# EAGLE design A7105 reference design (EAGLE 9.3.0)
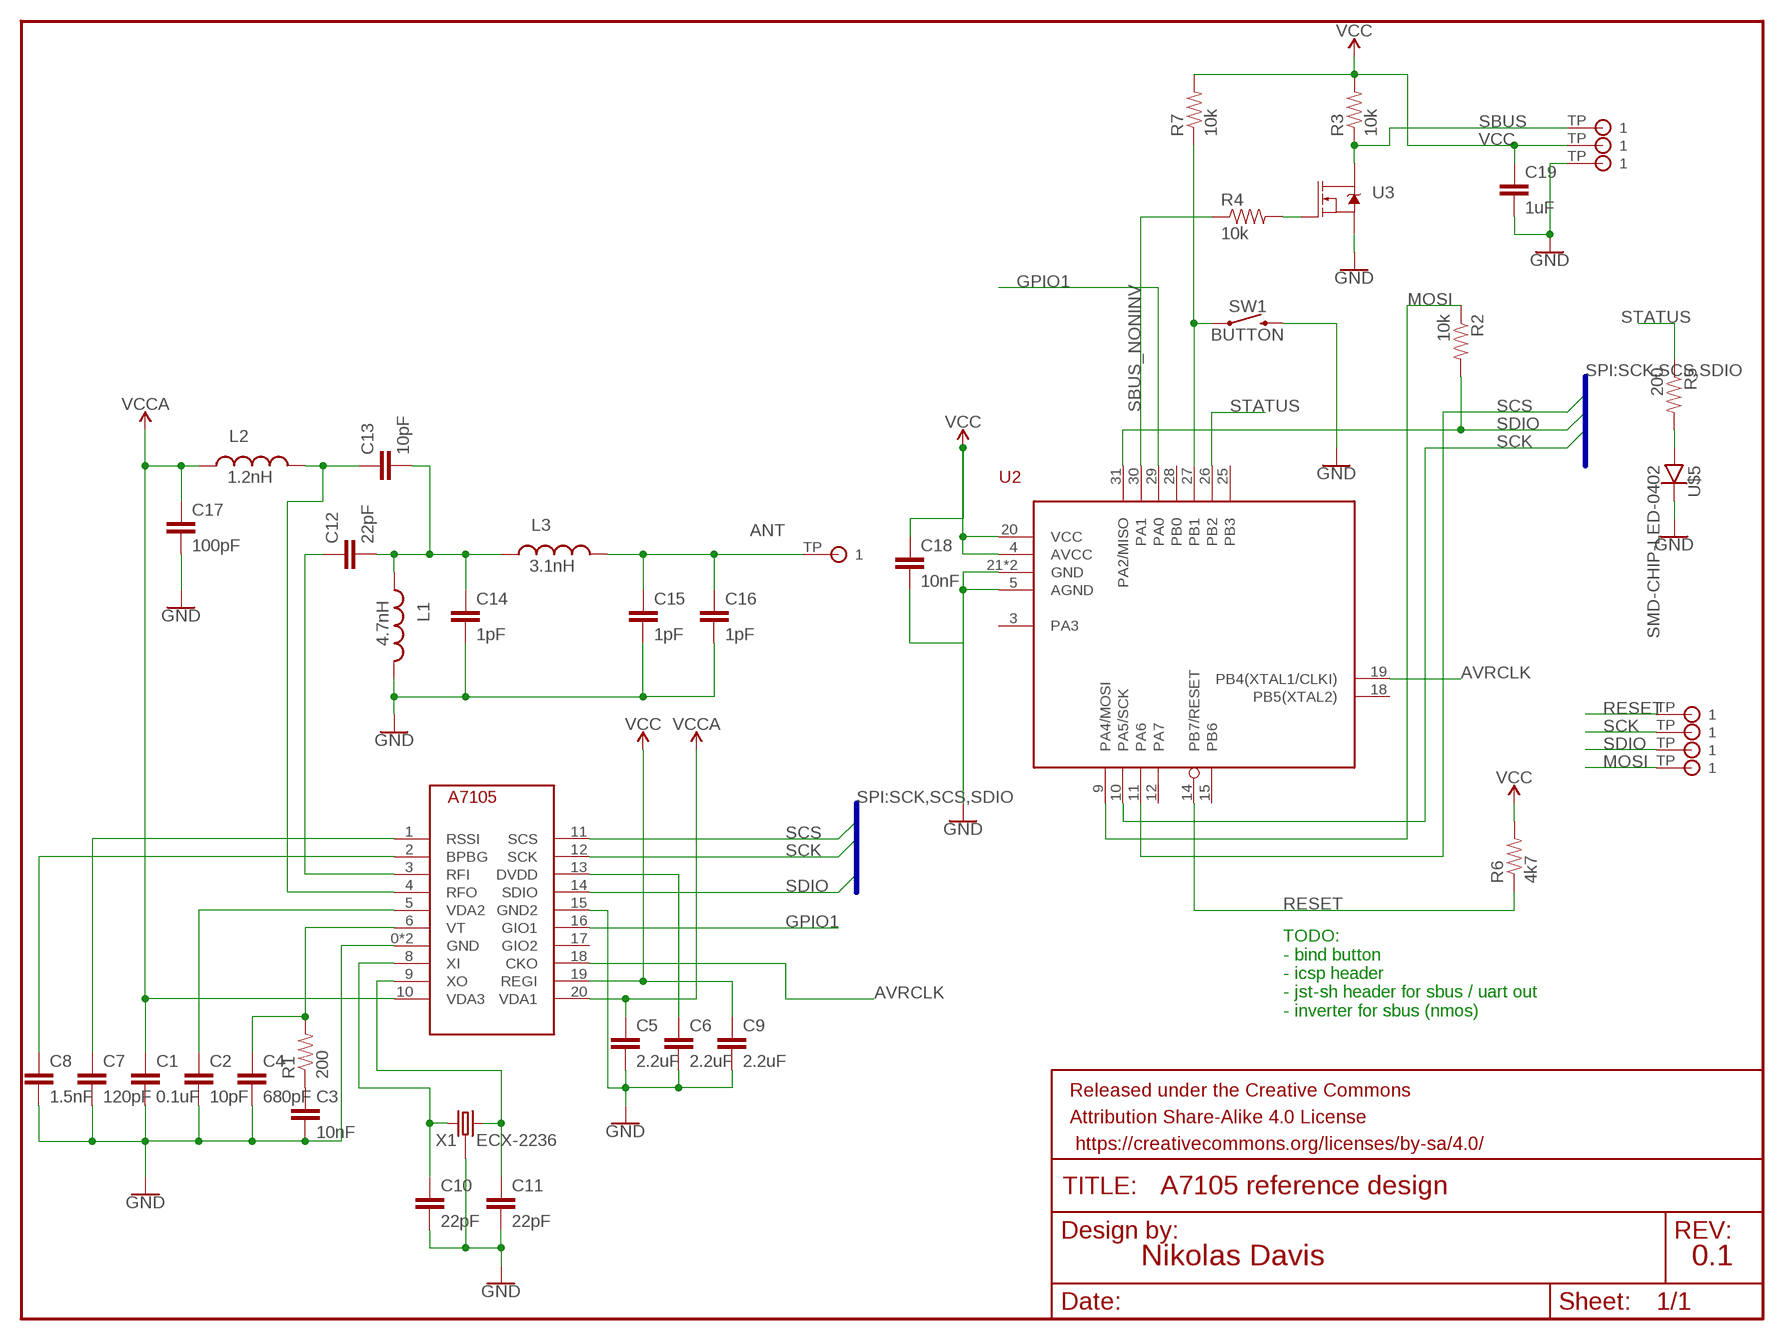
[diagram p0: schematic, sheet 1]

## Parts
ANT  TESTPAD  [TESTPAD]
C1  0.1uF  CAP_0402  [0402]
C2  10pF  CAP_0402  [0402]
C3  10nF  CAP_0402  [0402]
C4  680pF  CAP_0402  [0402]
C5  2.2uF  CAP_0402  [0402]
C6  2.2uF  CAP_0402  [0402]
C7  120pF  CAP_0402  [0402]
C8  1.5nF  CAP_0402  [0402]
C9  2.2uF  CAP_0402  [0402]
C10  22pF  CAP_0402  [0402]
C11  22pF  CAP_0402  [0402]
C12  22pF  CAP_0402  [0402]
C13  10pF  CAP_0402  [0402]
C14  1pF  CAP_0402  [0402]
C15  1pF  CAP_0402  [0402]
C16  1pF  CAP_0402  [0402]
C17  100pF  CAP_0402  [0402]
C18  10nF  CAP_0402  [0402]
C19  1uF  CAP_0402  [0402]
FRAME1  FRAME-LETTER  [CREATIVE_COMMONS]
L1  4.7nH  IND_0402  [0402]
L2  1.2nH  IND_0402  [0402]
L3  3.1nH  IND_0402  [0402]
R1  200  RES_0402  [0402]
R2  10k  RES_0402  [0402]
R3  10k  RES_0402  [0402]
R4  10k  RES_0402  [0402]
R5  200  RES_0402  [0402]
R6  4k7  RES_0402  [0402]
R7  10k  RES_0402  [0402]
SW1  BUTTON  [PTS-830-SMD-SWITCH]
U1  A7105  [QFN20-4X4MM]
U2  ATTINY167  [VQFN-32]
U3  NMOSSOT833B/1006  [SOT833B/DFN1006B-3]
U$5  SMD-CHIP-LED-0402  [0402LED]
U$6  TESTPAD  [TESTPAD]
U$7  TESTPAD  [TESTPAD]
U$8  TESTPAD  [TESTPAD]
U$9  TESTPAD  [TESTPAD]
U$10  TESTPAD  [TESTPAD]
U$11  TESTPAD  [TESTPAD]
U$12  TESTPAD  [TESTPAD]
X1  ECX-2236  [2.5X2.0MM_CRYSTAL]

## Nets
ANT: ANT.TP C15.1 C16.1 L3.2
AVRCLK: U1.18(CKO) U2.19(PB4(XTAL1/CLKI))
BIND: R7.1 SW1.P$1 SW1.P$2 U2.27(PB1)
G: R4.2 U3.P$1(G)
GND: C1.2 C2.2 C3.2 C4.2 C5.2 C6.2 C7.2 C8.2 C9.2 C10.2 C11.2 C14.2 C15.2 C16.2 C17.2 C18.2 C19.2 L1.2 SW1.P$3 SW1.P$4 U1.0(GND) U1.7(GND) U1.15(GND2) U2.5(AGND) U2.21(GND) U2.PAD(GND) U3.P$2(S) U$5.1(C) U$9.TP X1.P$2 X1.P$4
GPIO1: U1.16(GIO1) U2.29(PA0)
MOSI: R2.1 U2.9(PA4/MOSI) U$12.TP
N$1: C2.1 U1.5(VDA2)
N$2: C3.1 R1.1
N$3: C4.1 R1.2 U1.6(VT)
N$4: C6.1 U1.13(DVDD)
N$6: C7.1 U1.1(RSSI)
N$7: C8.1 U1.2(BPBG)
N$8: C11.1 U1.9(XO) X1.P$3
N$9: R5.2 U$5.2(A)
N$10: C12.2 C13.2 C14.1 L1.1 L3.1
N$13: C10.1 U1.8(XI) X1.P$1
RESET: R6.1 U2.14(PB7/RESET) U$7.TP
RFI: C12.1 U1.3(RFI)
RFO: C13.1 L2.2 U1.4(RFO)
SBUS: R3.1 U3.P$3(D) U$6.TP
SBUS_NONINV: R4.1 U2.30(PA1)
SCK: U1.12(SCK) U2.10(PA5/SCK) U$10.TP
SCS: U1.11(SCS) U2.11(PA6)
SDIO: R2.2 U1.14(SDIO) U2.31(PA2/MISO) U$11.TP
STATUS: R5.1 U2.26(PB2)
VCC: C9.1 C18.1 C19.1 R3.2 R6.2 R7.2 U1.19(REGI) U2.4(AVCC) U2.20(VCC) U$8.TP
VCCA: C1.1 C5.1 C17.1 L2.1 U1.10(VDA3) U1.20(VDA1)
Unconnected: U1.17(GIO2) U2.3(PA3) U2.12(PA7) U2.15(PB6) U2.18(PB5(XTAL2)) U2.25(PB3) U2.28(PB0)

## Buses
SPI:SCK,SCS,SDIO

## Notes on the sheet
- TODO:
  - bind button
  - icsp header
  - jst-sh header for sbus / uart out
  - inverter for sbus (nmos)
- Nikolas Davis | 0.1

## Library data of the parts
ANT U$6-U$12 = AlienWhoop:TESTPAD: Test pad also can be used for tiny solder pad for signal; BOM: EXCLUDE; DNP: T
C1-C19 = Perfect_0402:CAP_0402: 0402 (1005 Metric) Nick Garner - TeleSense
FRAME1 = SparkFun-Aesthetics:FRAME-LETTER: Schematic Frame - Letter Standard 8.5x11 US Letter frame
L1-L3 = Perfect_0402:IND_0402: 0402
R1-R7 = Perfect_0402:RES_0402: 0402 (1005 Metric) Nick Garner - TeleSense
SW1 = nikdavis:BUTTON
U1 = nikdavis:A7105: 2.4GHz RF chip used with Flysky transmitters and receivers
U2 = nikdavis:ATTINY167
U3 = nikdavis:NMOS
U$5 = alienflight:SMD-CHIP-LED-0402: 0402 BLUE LED APG1005PBC-T-5MAV 1.0 x 0.5 x 0.2 mm (0402) SMD Chip LED Lamp https://www.mouser.com/ds/2/216/APG1005PBC-T-5MAV-315779.pdf
X1 = nikdavis:ECX-2236

## Board
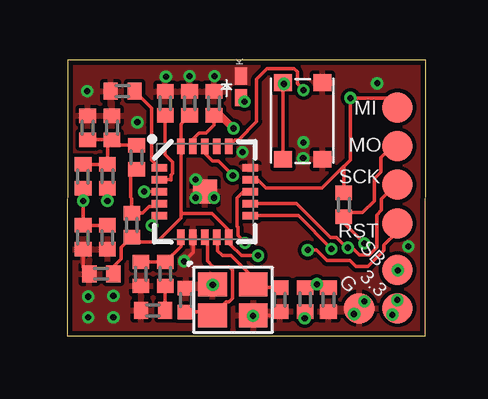
[diagram p1: board, top side]
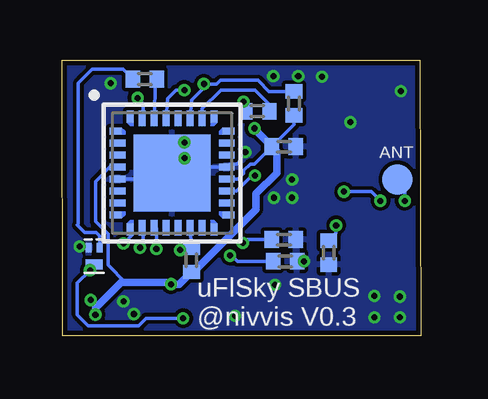
[diagram p2: board, bottom side, seen from below]

Size 14.96 x 11.52 mm. Coordinates in mm from the lower left corner, seen from the top.
Outline: 0,0 14.93,0 14.96,11.52 0.03,11.52 0,0
Copper layers (1*16): Top 0.035mm / dielectric 1.5mm / Bottom 0.035mm
Design rules "default *": minimum track width 6mil, minimum drill 10mil, track to track 6mil, track to pad 6mil, pad to pad 6mil, via to via 6mil, smd to smd 6mil, copper to edge 8mil, drill to drill 6mil, minimum pad ring 10mil, minimum via ring 5mil, stop-mask expansion 4mil, vias tented up to drill 20mil, thermal gap 6mil

### Footprints (pad centres in the part's own frame; a part is rotated, then mirrored left to right if it is on the bottom)
TESTPAD = smd 1.27 x 1.27: TP 0,0
0402 = smd 0.6 x 0.7: 1 -0.5,0; 2 0.5,0
PTS-830-SMD-SWITCH = smd 0.7 x 0.75: P$1 0.35,2.025; P$2 3.55,2.025; P$3 3.55,0.375; P$4 0.35,0.375
QFN20-4X4MM = smd 1 x 1: 0 0,0 | smd 0.65 x 0.3: 1 -1.9,1; 2 -1.9,0.5; 3 -1.9,0; 4 -1.9,-0.5; 5 -1.9,-1; 11 1.9,-1; 12 1.9,-0.5; 13 1.9,0; 14 1.9,0.5; 15 1.9,1 | smd 0.3 x 0.65: 6 -1,-1.9; 7 -0.5,-1.9; 8 0,-1.9; 9 0.5,-1.9; 10 1,-1.9; 16 1,1.9; 17 0.5,1.9; 18 0,1.9; 19 -0.5,1.9; 20 -1,1.9
VQFN-32 = smd 0.5 x 0.3: 1 -2.35,1.75; 8 -2.35,-1.75; 17 2.35,-1.75; 24 2.35,1.75 | smd 0.65 x 0.3: 2 -2.275,1.25; 3 -2.275,0.75; 4 -2.275,0.25; 5 -2.275,-0.25; 6 -2.275,-0.75; 7 -2.275,-1.25; 18 2.275,-1.25; 19 2.275,-0.75; 20 2.275,-0.25; 21 2.275,0.25; 22 2.275,0.75; 23 2.275,1.25 | smd 0.3 x 0.5: 9 -1.75,-2.35; 16 1.75,-2.35; 25 1.75,2.35; 32 -1.75,2.35 | smd 0.3 x 0.65: 10 -1.25,-2.275; 11 -0.75,-2.275; 12 -0.25,-2.275; 13 0.25,-2.275; 14 0.75,-2.275; 15 1.25,-2.275; 26 1.25,2.275; 27 0.75,2.275; 28 0.25,2.275; 29 -0.25,2.275; 30 -0.75,2.275; 31 -1.25,2.275 | smd 3.2 x 3.2: PAD 0,0
SOT833B/DFN1006B-3 = smd 0.4 x 0.25: P$1 0.2,0.575; P$2 0.2,0.125 | smd 0.4 x 0.7: P$3 0.9,0.35
0402LED = smd 0.7 x 0.5: 1 -0.45,0; 2 0.45,0
2.5X2.0MM_CRYSTAL = smd 1.2 x 1: P$1 0.6,0.5; P$2 2.3,0.5; P$3 2.3,1.8; P$4 0.6,1.8

### Placement (x,y rotation side)
ANT  0.97,6.53 0 bottom
C1  5.66,3.12 0 bottom
C2  3.84,3.48 270 bottom
C3  3.58,1.07 180 top
C4  3.07,2.59 270 top
C5  5.11,9.7 90 top
C6  5.71,4.02 0 bottom
C7  2.31,10.21 180 top
C8  4.09,9.7 90 top
C9  6.12,9.7 90 top
C10  4.95,1.5 90 top
C11  8.87,1.52 270 top
C12  1.68,6.65 90 top
C13  2.89,7.45 90 top
C14  0.85,8.69 90 top
C15  1.68,4.11 270 top
C16  0.66,4.11 270 top
C17  1.42,2.59 180 top
C18  5.71,7.9 0 bottom
C19  10.9,1.52 270 top
FRAME1  -80.01,1.27 0 top  (outside the outline)
L1  1.87,8.69 90 top
L2  2.69,4.62 90 top
L3  0.66,6.65 270 top
R1  4.09,2.59 90 top
R2  11.53,5.47 90 top
R3  9.92,1.52 90 top
R4  11.5,10.71 180 bottom
R5  6.81,9.37 180 bottom
R6  9.56,3.17 270 bottom
R7  5.28,9.7 270 bottom
SW1  11.02,7.02 90 top
U1  5.74,6.02 0 top
U2  10.36,6.8 0 bottom
U3  13.97,3.89 270 bottom
U$5  7.24,10.39 270 top
U$6  13.78,2.75 0 top
U$7  13.77,4.7 0 top
U$8  13.78,1.15 0 top
U$9  12.18,1.15 0 top
U$10  13.77,6.31 0 top
U$11  13.77,9.53 0 top
U$12  13.77,7.92 0 top
X1  5.46,0.36 0 top

### Tracks (layer width: path | path; a pad name or v marks a point on that pad's centre or on a via)
ANT  (via drill 0.25)
  Top 0.152: C15.1 C16.1 v0.66,5.64 L3.2
  Bottom 0.152: ANT.TP 0.66,6.22 v0.66,5.64
AVRCLK  (via drill 0.25)
  Top 0.152: v6.91,6.7 6.32,7.29 6.07,7.29 5.74,7.62 U1.18
  Bottom 0.152: v6.91,6.7 6.93,6.67 7.06,6.67 7.68,6.05 U2.19
BIND  (via drill 0.25 pad 0.51)
  Top 0.152: v9.04,10.52 SW1.P$2 SW1.P$1
  Bottom 0.152: U2.27 9.56,9.85 9.04,10.36 v9.04,10.52 8.51,10.52 8.36,10.67 6.78,10.67 6.32,10.2 R7.1
G
  Bottom 0.152: R4.2 12.42,11.12 13.69,11.12 14.28,10.54 14.28,4.67 14.33,4.62 14.02,4.32 13.54,4.32 13.39,4.17 U3.P$1
GND  (via drill 0.25, 0.25 pad 0.51)
  Top 0.152: C17.2 0.66,2.85 C16.2 | U1.7 5.24,3.49 v4.87,3.12 | X1.P$2 8.7,0.86 C11.2
  Bottom 0.152: U2.5 10.99,6.55 10.97,6.53 10.58,6.53 U2.PAD 10.06,7.05 U2.21 7.96,7.17 7.67,7.17 7.53,7.3 7.53,7.6 7.46,7.67 v7.32,7.67 | C1.2 v4.87,3.12
  Bottom 0.305: U2.PAD 10.31,6.8 10.07,7.04 10.07,7.19 v9.84,7.42
  other vias: 5.36,5.77 6.12,5.77 5.36,6.53 0.83,10.22 1.93,1.67 1.93,0.77 0.87,0.77 0.87,1.64 12.4,1.45 11.96,0.91 7.75,0.84 6.07,2.13 14.22,3.73 12.93,10.54 9.86,8.08 2.93,8.92 4.11,10.82 5.11,10.85 6.15,10.85
  pour Top: 0,0 0,15.24 17.78,15.24 17.78,0
  pour Bottom (isolate 0.127): 0,0 0,15.24 17.78,15.24 17.78,0
GPIO1  (via drill 0.25 pad 0.51)
  Top 0.152: U1.16 7,8.18 7.13,8.18 7.9,8.94 7.9,10.72 8.33,11.15 9.46,11.15 9.6,11.02 9.6,10.52 v9.86,10.26
  Bottom 0.152: U2.29 10.56,9.91 10.21,10.26 v9.86,10.26
MOSI  (via drill 0.25 pad 0.51)
  Top 0.152: v12.39,3.86 11.53,4.72 R2.1 11.72,5.16 12.32,5.16 12.8,5.64 12.8,6.56 13.08,6.84 13.08,7.44 13.56,7.92 U$12.TP
  Bottom 0.152: v12.39,3.86 12.06,4.2 U2.9
N$1  (via drill 0.25)
  Top 0.152: U1.5 3.52,4.71 v3.52,4.62
  Bottom 0.152: C2.1 3.52,4.29 v3.52,4.62
N$2
  Top 0.152: R1.1 C3.1
N$3
  Top 0.152: C4.1 R1.2 4.74,3.74 U1.6
N$4  (via drill 0.25 pad 0.51)
  Top 0.152: U1.13 7.62,6 7.32,6 7.09,5.76 7.09,4.57 7.12,4.54 7.12,4.18 v7.42,3.89
  Bottom 0.152: C6.1 7.28,4.02 v7.42,3.89
N$6
  Top 0.152: C7.1 3.51,9.51 3.51,8.81 3.52,8.79 3.52,7.33 U1.1
N$7
  Top 0.152: C8.1 4.09,7.57 4.39,7.26 4.39,6.78 4.33,6.71 4.33,6.52 4.32,6.52 U1.2
N$8
  Top 0.152: U1.9 6.27,4.09 6.27,3.56 6.48,3.35 6.83,3.35 7.76,2.42 X1.P$3 7.89,2.02 C11.1
N$9  (via drill 0.25)
  Top 0.152: U$5.2 v7.39,9.79 v7.39,9.78
  Bottom 0.152: v7.39,9.78 7.31,9.7 R5.2
N$10
  Top 0.152: C13.2 2.1,7.96 L1.1 | L1.1 C14.1 | L3.1 C12.2 1.68,8 L1.1
N$13
  Top 0.152: C10.1 5.92,1 X1.P$1 6.63,1.43 6.76,1.43 6.89,1.56 6.89,2.75 6.76,2.88 6.08,2.88 5.84,3.12 5.84,4.02 U1.8
RESET  (via drill 0.25 pad 0.51)
  Top 0.152: v10.03,3.58 10.39,3.58 10.82,3.15 11.79,3.15 12.04,2.9 12.54,2.9 13.21,3.56 13.21,3.79 13.77,4.35 U$7.TP
  Bottom 0.152: U2.14 R6.1 9.65,3.58 v10.03,3.58
RFI  (via drill 0.25)
  Top 0.152: C12.1 v1.68,5.64 | U1.3 v3.2,6.02
  Bottom 0.152: v3.2,6.02 2.06,6.02 v1.68,5.64
RFO
  Top 0.152: U1.4 3.72,5.4 3.42,5.4 3.15,5.12 L2.2 2.69,5.74 2.64,5.79 2.64,6.7 C13.1
SBUS  (via drill 0.25 pad 0.51)
  Top 0.152: R3.1 9.92,0.75 v9.91,0.74 | U$6.TP v13.79,2.74
  Bottom 0.152: v9.91,0.74 11.46,0.74 11.76,0.43 13.87,0.43 14.33,0.89 14.33,2.21 v13.79,2.74 13.62,2.92 U3.P$3
SBUS_NONINV
  Bottom 0.152: U2.30 11.06,10.65 R4.1
SCK  (via drill 0.25 pad 0.51)
  Top 0.152: U1.12 9.57,5.52 10.97,4.12 11.22,4.12 11.65,3.68 v11.71,3.68 11.89,3.68 12.2,3.38 12.6,3.38 12.91,3.69 12.91,5.06 13.11,5.26 13.11,5.71 13.7,6.31 U$10.TP
  Bottom 0.152: v11.71,3.68 11.56,3.83 U2.10
SCS  (via drill 0.25 pad 0.51)
  Top 0.152: U1.11 9.64,5.02 v11.02,3.63
  Bottom 0.152: v11.02,3.63 11.02,4.49 U2.11
SDIO  (via drill 0.25 pad 0.51)
  Top 0.152: 11.53,7.06 11.52,7.07 10.62,6.17 8.29,6.17 7.94,6.52 U1.14 | 11.53,7.06 R2.2 | U$11.TP 13.37,9.93 v11.81,9.93 11.81,7.34 11.53,7.06
  Bottom 0.152: U2.31 11.56,9.68 v11.81,9.93
STATUS
  Bottom 0.152: U2.26 9.11,9.48 8.33,10.26 6.91,10.26 6.31,9.66 R5.1
VCC  (via drill 0.25 pad 0.51)
  Top 0.152: C9.1 6.12,8.8 5.79,8.47 5.5,8.47 5.24,8.22 U1.19 | R3.2 10.06,2.16 v10.41,2.16 10.76,2.16 C19.1
  Top 0.305: C9.1 6.39,9.2 v6.93,8.66 | v13.56,0.89 13.78,1.1 U$8.TP v13.78,1.49 v13.77,1.5
  Bottom 0.152: U2.20 7.61,6.55 7.39,6.77 7.39,6.9 7.11,7.18 6.92,7.18 C18.1 5.28,8.82 R7.2 | 12.32,2.23 13.04,2.96 13.04,4.25 13.56,4.77 13.56,6.45 12.97,7.05 U2.4 | v6.93,8.66 6.92,8.64 6.92,8.61
  Bottom 0.305: 13.56,1.17 12.5,2.23 12.32,2.23 10.49,2.23 v10.41,2.16 10.07,2.16 R6.2 9.47,2.67 6.86,5.28 6.86,5.94 5.99,6.81 5.99,7.69 C18.1 6.92,8.61 | v13.77,1.5 13.56,1.29 13.56,1.17 | v13.56,0.89 13.56,1.17
VCCA  (via drill 0.25 pad 0.51)
  Top 0.152: C5.1 4.74,8.84 U1.20 4.74,5.12 | 4.74,5.12 4.74,4.92 3.75,3.92 2.89,3.92 L2.1 2.25,3.69 2.25,3.22 1.92,2.89 C17.1 | 4.74,5.12 6.04,5.12 6.75,4.41 U1.10 6.81,4.05 6.81,3.81 7.27,3.35 v7.95,3.35
  Bottom 0.152: C1.1 7.64,3.12 7.87,3.35 v7.95,3.35

### Text on the board
tPlace: MI | MO | SCK | RST | SB | G | 3.3
bNames: uFlSky SBUS / @nivvis V0.3